# Altium schematic sheet 30_ADC.SchDoc
size A; SheetNumber: 4; SheetTotal: 8
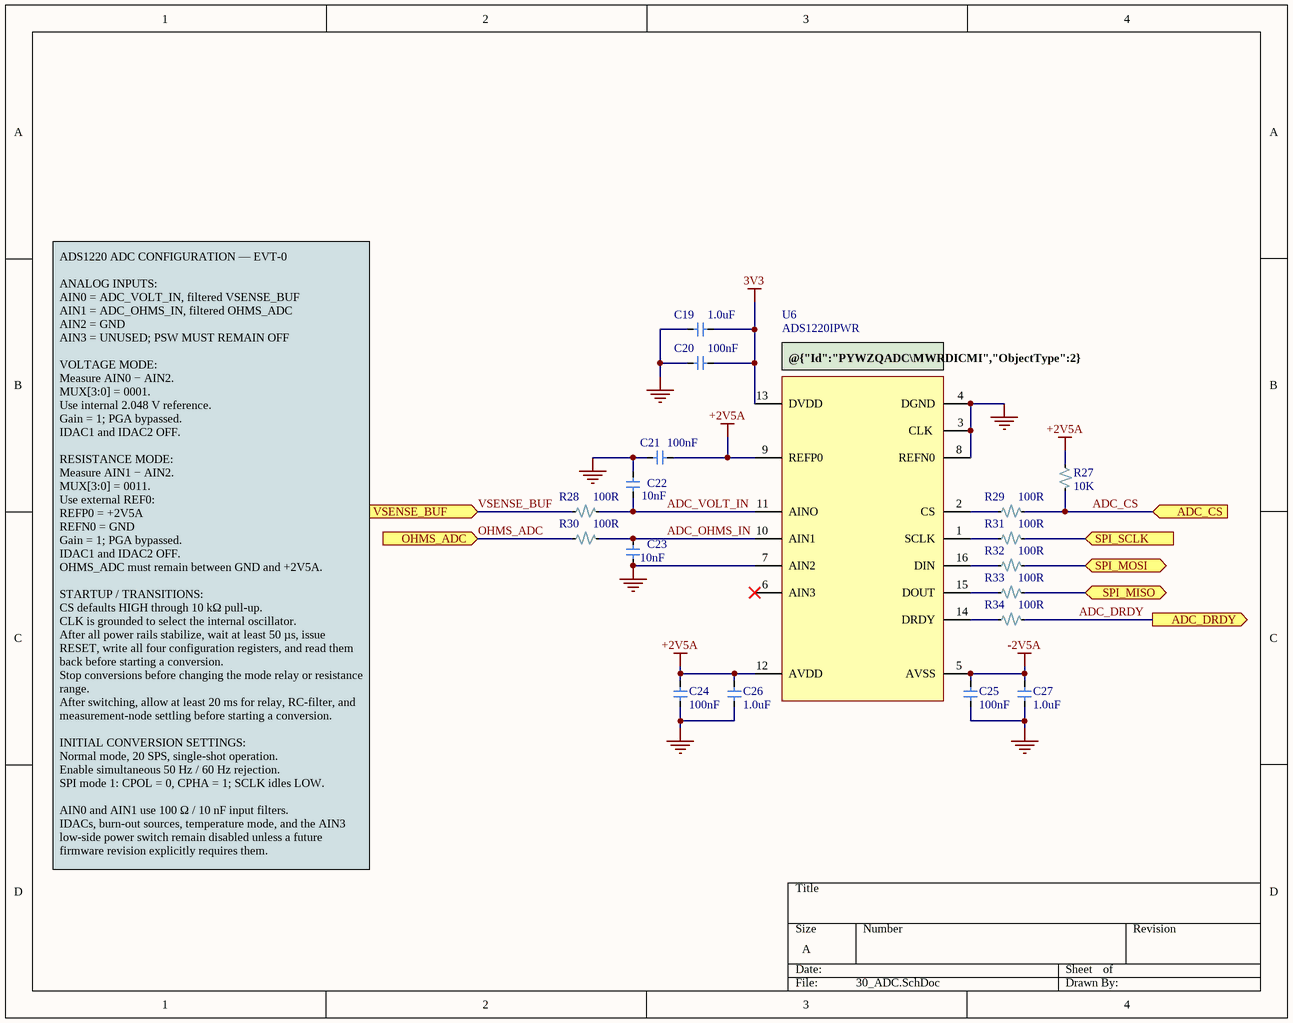
[diagram p0: 30_ADC.SchDoc]

## Parts
C19  1.0uF  [C0805]
C20  100nF  [C0805]
C21  100nF  [C0805]
C22  10nF  [C0805]
C23  10nF  [C0805]
C24  100nF  [C0805]
C25  100nF  [C0805]
C26  1.0uF  [C0805]
C27  1.0uF  [C0805]
R27  10K  [R0805]
R28  100R  [R0805]
R29  100R  [R0805]
R30  100R  [R0805]
R31  100R  [R0805]
R32  100R  [R0805]
R33  100R  [R0805]
R34  100R  [R0805]
U6  ADS1220IPWR  [ADS1220IPWR]

## Ports
ADC_CS (in, see 00_SYSTEM_TOP[2C], 20_MCU_BLE[1B]), ADC_DRDY (out, see 00_SYSTEM_TOP[2C], 20_MCU_BLE[1B]), OHMS_ADC (in, see 00_SYSTEM_TOP[3C], 60_RESISTANCE_FRONTEND[2B]), SPI_MISO (bidir, see 00_SYSTEM_TOP[2C], 20_MCU_BLE[1B], 70_MODULE_INTERFACE[4C]), SPI_MOSI (bidir, see 00_SYSTEM_TOP[2C], 20_MCU_BLE[1B], 70_MODULE_INTERFACE[4C]), SPI_SCLK (in, see 00_SYSTEM_TOP[2C], 20_MCU_BLE[1B], 70_MODULE_INTERFACE[4C]), VSENSE_BUF (in, see 00_SYSTEM_TOP[3C], 50_VOLTAGE_FRONTEND[4C])

## Nets
3V3: C19.2 C20.2 U6.13(DVDD)
+2V5A: C21.2 C24.2 C26.2 R27.1 U6.9(REFP0) U6.12(AVDD)
-2V5A: C25.2 C27.1 U6.5(AVSS)
GND: C19.1 C20.1 C21.1 C22.2 C23.1 C24.1 C25.1 C26.1 C27.2 U6.3(CLK) U6.4(DGND) U6.7(AIN2) U6.8(REFN0)
ADC_CS: R27.2 R29.2 ; port ADC_CS
ADC_DRDY: R34.2 ; port ADC_DRDY
ADC_OHMS_IN: C23.2 R30.2 U6.10(AIN1)
ADC_VOLT_IN: C22.1 R28.2 U6.11(AINO)
OHMS_ADC: R30.1 ; port OHMS_ADC
SPI_MISO: R33.2 ; port SPI_MISO
SPI_MOSI: R32.2 ; port SPI_MOSI
SPI_SCLK: R31.2 ; port SPI_SCLK
VSENSE_BUF: R28.1 ; port VSENSE_BUF
NetR29_1: R29.1 U6.2(CS)
NetR31_1: R31.1 U6.1(SCLK)
NetR32_1: R32.1 U6.16(DIN)
NetR33_1: R33.1 U6.15(DOUT)
NetR34_1: R34.1 U6.14(DRDY)

Not connected (* = marked no-connect by the designer): U6 6(AIN3)*

## Notes on the sheet
- (near U6) @{"Id":"PYWZQADC\MWRDICMI","ObjectType":2} V/Ω Sense ADC
- ADS1220 ADC CONFIGURATION — EVT-0
  ANALOG INPUTS:
  AIN0 = ADC_VOLT_IN, filtered VSENSE_BUF
  AIN1 = ADC_OHMS_IN, filtered OHMS_ADC
  AIN2 = GND
  AIN3 = UNUSED; PSW MUST REMAIN OFF
  VOLTAGE MODE:
  Measure AIN0 − AIN2.
  MUX[3:0] = 0001.
  Use internal 2.048 V reference.
  Gain = 1; PGA bypassed.
  IDAC1 and IDAC2 OFF.
  RESISTANCE MODE:
  Measure AIN1 − AIN2.
  MUX[3:0] = 0011.
  Use external REF0:
  REFP0 = +2V5A
  REFN0 = GND
  Gain = 1; PGA bypassed.
  IDAC1 and IDAC2 OFF.
  OHMS_ADC must remain between GND and +2V5A.
  STARTUP / TRANSITIONS:
  CS defaults HIGH through 10 kΩ pull-up.
  CLK is grounded to select the internal oscillator.
  After all power rails stabilize, wait at least 50 µs, issue RESET, write all four configuration registers, and read them back before starting a conversion.
  Stop conversions before changing the mode relay or resistance range.
  After switching, allow at least 20 ms for relay, RC-filter, and measurement-node settling before starting a conversion.
  INITIAL CONVERSION SETTINGS:
  Normal mode, 20 SPS, single-shot operation.
  Enable simultaneous 50 Hz / 60 Hz rejection.
  SPI mode 1: CPOL = 0, CPHA = 1; SCLK idles LOW.
  AIN0 and AIN1 use 100 Ω / 10 nF input filters.
  IDACs, burn-out sources, temperature mode, and the AIN3 low-side power switch remain disabled unless a future firmware revision explicitly requires them.

## Library data of the parts
C19-C27 = C_0805
R27-R34 = R_0805: RES 1/8W 0805; Manufacturer: Stackpole Electronics; Manufacturer Part Number: RNCF0805TKY10K0; Manufacturer Package Identifier: 0805 (2012 metric); Max Power Dissipation: 125mW; Value: 10kΩ; Temperature Coefficient: 5ppm/°C; Tolerance: 0.01%; Working Voltage: 150V; Supplier: DigiKey; Supplier Part Number: RNCF0805TKY10K0CT-ND; RoHS: Compliant; Category: Chip SMD Resistors; Stock: 4649; Pricing: 1=1.61, 10=1.334, 50=1.1716, 100=1.1105, 500=0.99044, 1000=0.94751, 2000=0.90945, 3000=0.8893, 5000=0.86599, 7000=0.85183, 10000=0.8378 (USD); Case/Package: 0805; Case Code (Imperial): 0805; Case Code (Metric): 2012; Composition: Thin Film; Country of Origin: Taiwan; Export Control Classification Number (ECCN) Code: EAR99; Features: Moisture Resistant; Height: 550µm; Harmonized Tariff Schedule (HTS) Code: 8533.21.00.30; Introduction Date: 2011-06-03; Lead Free: Lead Free; Length: 2mm; Lifecycle Status: Production; Max Operating Temperature: 155°C; Min Operating Temperature: -55°C; Mounting Technology: Surface Mount; Number of Terminals: 2; Number of Terminations: 2; Packaging: Tape & Reel (TR); Power Rating: 125mW; Ratings: AEC-Q200; REACH SVHC: Yes; Schedule B: 8533210045, 8533210045|8533210045|8533210045|8533210045|8533210045; Width: 1.25mm; ComponentLink1URL: https://datasheet.octopart.com:443/RNCF0805TKY10K0-Stackpole-Electronics-datasheet-182148124.pdf?src-supplier=IHS; ComponentLink1Description: https://datasheet.octopart.com:443/RNCF0805TKY10K0-Stackpole-Electronics-datasheet-182148124.pdf?src-supplier=IHS; ComponentLink2URL: https://datasheet.octopart.com:443/RNCF0805TKY10K0-Stackpole-Electronics-datasheet-12511394.pdf?src-supplier=Factory+Futures; ComponentLink2Description: https://datasheet.octopart.com:443/RNCF0805TKY10K0-Stackpole-Electronics-datasheet-12511394.pdf?src-supplier=Factory+Futures; ComponentLink3URL: https://datasheet.octopart.com:443/RNCF0805TKY10K0-Stackpole-Electronics-datasheet-141158876.pdf?src-supplier=Stackpole+Electronics; ComponentLink3Description: https://datasheet.octopart.com:443/RNCF0805TKY10K0-Stackpole-Electronics-datasheet-141158876.pdf?src-supplier=Stackpole+Electronics; ComponentLink4URL: https://datasheet.octopart.com:443/RNCF0805TKY10K0-Stackpole-Electronics-datasheet-28504821.pdf?src-supplier=Master+Electronics; ComponentLink4Description: https://datasheet.octopart.com:443/RNCF0805TKY10K0-Stackpole-Electronics-datasheet-28504821.pdf?src-supplier=Master+Electronics; ComponentLink5URL: https://datasheet.octopart.com/RNCF0805TKY10K0-Stackpole-Electronics-datasheet-11755897.pdf; ComponentLink5Description: https://datasheet.octopart.com/RNCF0805TKY10K0-Stackpole-Electronics-datasheet-11755897.pdf; ComponentLink6URL: http://sigma.octopart.com:80/15941409/materials_sheet/Stackpole-Electronics-RNCF0805TKY10K0.pdf?src-supplier=Compliance+Statements; ComponentLink6Description: http://sigma.octopart.com:80/15941409/materials_sheet/Stackpole-Electronics-RNCF0805TKY10K0.pdf?src-supplier=Compliance+Statements; ComponentLink7URL: http://sigma.octopart.com:80/141158212/rohs_statement/Stackpole-Electronics-RNCF0805TKY10K0.pdf?src-supplier=Compliance+Statements; ComponentLink7Description: http://sigma.octopart.com:80/141158212/rohs_statement/Stackpole-Electronics-RNCF0805TKY10K0.pdf?src-supplier=Compliance+Statements; ComponentLink8URL: http://sigma.octopart.com:80/141158211/reach_statement/Stackpole-Electronics-RNCF0805TKY10K0.pdf?src-supplier=Compliance+Statements; ComponentLink8Description: http://sigma.octopart.com:80/141158211/reach_statement/Stackpole-Electronics-RNCF0805TKY10K0.pdf?src-supplier=Compliance+Statements
U6 = ADS1220IPWR: IC ADC 24BIT 16-TSSOP; Manufacturer: Texas Instruments; Manufacturer Lifecycle Status: ACTIVE; Interface: SPI; Max Power Dissipation: 1.4mW; Max Supply Voltage: 5.5V; Min Supply Voltage: 2.3V; Number of A/D Converters: 1; Number of Analog Inputs: 4; Number of Bits: 24; Operating Supply Voltage: 3.3V; Polarity: Bipolar, Unipolar; Power Dissipation: 2.1mW; Resolution: 3B; Sampling Rate: 2ksps; Supply Type: Analog, Digital, Dual; Supplier: DigiKey; Supplier Part Number: 296-39851-1-ND; Manufacturer Part Number: ADS1220IPWR; RoHS: Compliant; Category: Analog to Digital Converters (ADCs); Stock: 4099; Pricing: 1=9.26, 10=7.201, 25=6.6852, 100=6.1189, 250=6.0022 (USD); Case/Package: TSSOP; Contact Plating: Gold; Height: 1.2mm; Lead Free: Lead Free; Length: 5mm; Lifecycle Status: Production; Max Operating Temperature: 125°C; Min Operating Temperature: -40°C; Mounting Technology: Surface Mount; Number of Channels: 1; Number of Converters: 1; Number of Elements: 1; Number of Inputs: 4; Pins: 16; Radiation Hardening: No; Schedule B: 8542390000; Thickness: 1mm; Width: 4.4mm; ComponentLink1URL: https://sigma.octopart.com:443/189718192/technical_drawing/Texas-Instruments-ADS1220IPWR.pdf?src-supplier=Texas+Instruments; ComponentLink1Description: https://sigma.octopart.com:443/189718192/technical_drawing/Texas-Instruments-ADS1220IPWR.pdf?src-supplier=Texas+Instruments; ComponentLink2URL: https://octopart.com:443/opatz8j6/c1?t=BlS52qY4T5w8A7uK_HjLnxNLo9uk59_RYYMo9dLg0oO2cMi-18kly1ZKdJe2qPDbDx0L3HGY3S0lPPROM-3fqYypc313GSW7Fpej1V_dswjApvxmFTIjwfDPB1ymsghsFF1peKDlQOxzEpi3-yutT465CQ4oB2kBM5WiUtcuO2mNwVfA-IWeTnfaQkyq_eP44orWu8X7V80Vir55GCaJJNnMK-Ri4IeRAVNqOHGPv58lWeY5n0YLEge8tXITw4M_cEEmDQjwStTzdakIywHbSoPuvyHyNGZa9yCPf7we15vfNr4UaaVf2RPbk6oPXb3t4UGaAVG0yF_k74fBuIdALnp98NtoYrGWv25hANVM8CHAoYO8J4TnYaXtD7mx8qsTT-nMoCs&src-supplier=Texas+Instruments; ComponentLink2Description: https://octopart.com:443/opatz8j6/c1?t=BlS52qY4T5w8A7uK_HjLnxNLo9uk59_RYYMo9dLg0oO2cMi-18kly1ZKdJe2qPDbDx0L3HGY3S0lPPROM-3fqYypc313GSW7Fpej1V_dswjApvxmFTIjwfDPB1ymsghsFF1peKDlQOxzEpi3-yutT465CQ4oB2kBM5WiUtcuO2mNwVfA-IWeTnfaQkyq_eP44orWu8X7V80Vir55GCaJJNnMK-Ri4IeRAVNqOHGPv58lWeY5n0YLEge8tXITw4M_cEEmDQjwStTzdakIywHbSoPuvyHyNGZa9yCPf7we15vfNr4UaaVf2RPbk6oPXb3t4UGaAVG0yF_k74fBuIdALnp98NtoYrGWv25hANVM8CHAoYO8J4TnYaXtD7mx8qsTT-nMoCs&src-supplier=Texas+Instruments; ComponentLink3URL: https://sigma.octopart.com:443/116621398/technical_drawing/Texas-Instruments-ADS1220IPWR.pdf?src-supplier=Texas+Instruments; ComponentLink3Description: https://sigma.octopart.com:443/116621398/technical_drawing/Texas-Instruments-ADS1220IPWR.pdf?src-supplier=Texas+Instruments; ComponentLink4URL: https://datasheet.octopart.com:443/ADS1220IPWR-Texas-Instruments-datasheet-37484719.pdf?src-supplier=Texas+Instruments; ComponentLink4Description: https://datasheet.octopart.com:443/ADS1220IPWR-Texas-Instruments-datasheet-37484719.pdf?src-supplier=Texas+Instruments; ComponentLink5URL: https://datasheet.octopart.com:443/ADS1220IPWR-Texas-Instruments-datasheet-16941236.pdf?src-supplier=Texas+Instruments; ComponentLink5Description: https://datasheet.octopart.com:443/ADS1220IPWR-Texas-Instruments-datasheet-16941236.pdf?src-supplier=Texas+Instruments; ComponentLink6URL: https://datasheet.octopart.com:443/ADS1220IPWR-Texas-Instruments-datasheet-15761565.pdf?src-supplier=Texas+Instruments; ComponentLink6Description: https://datasheet.octopart.com:443/ADS1220IPWR-Texas-Instruments-datasheet-15761565.pdf?src-supplier=Texas+Instruments; ComponentLink7URL: https://sigma.octopart.com:443/49249815/technical_drawing/Texas-Instruments-ADS1220IPWR.pdf?src-supplier=Texas+Instruments; ComponentLink7Description: https://sigma.octopart.com:443/49249815/technical_drawing/Texas-Instruments-ADS1220IPWR.pdf?src-supplier=Texas+Instruments; ComponentLink8URL: https://datasheet.octopart.com:443/ADS1220IPWR-Texas-Instruments-datasheet-159675426.pdf?src-supplier=SHENGYU+ELECTRONICS; ComponentLink8Description: https://datasheet.octopart.com:443/ADS1220IPWR-Texas-Instruments-datasheet-159675426.pdf?src-supplier=SHENGYU+ELECTRONICS; ComponentLink9URL: https://datasheet.octopart.com:443/ADS1220IPWR-Texas-Instruments-datasheet-165986363.pdf?src-supplier=LCSC; ComponentLink9Description: https://datasheet.octopart.com:443/ADS1220IPWR-Texas-Instruments-datasheet-165986363.pdf?src-supplier=LCSC; ComponentLink10URL: http://sigma.octopart.com:80/reach_statement/Texas-Instruments-company-64.pdf?src-supplier=Compliance+Statements; ComponentLink10Description: http://sigma.octopart.com:80/reach_statement/Texas-Instruments-company-64.pdf?src-supplier=Compliance+Statements; ComponentLink11URL: http://sigma.octopart.com:80/conflict_mineral_statement/Texas-Instruments-company-63.pdf?src-supplier=Compliance+Statements; ComponentLink11Description: http://sigma.octopart.com:80/conflict_mineral_statement/Texas-Instruments-company-63.pdf?src-supplier=Compliance+Statements